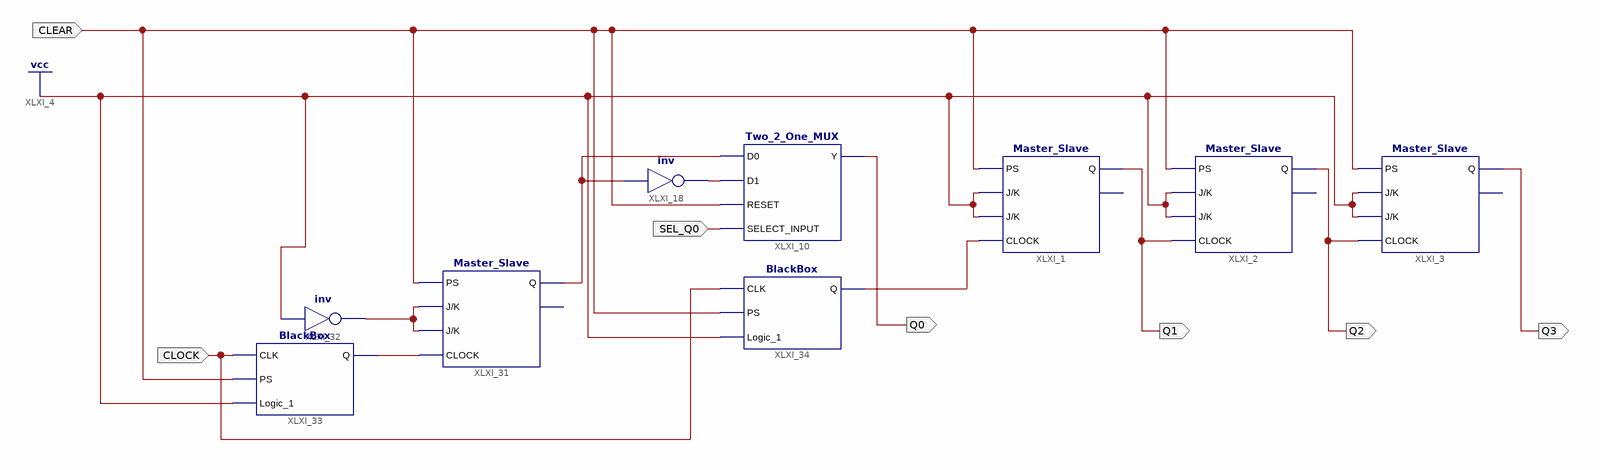
[diagram p0: schematic sheet 1]
// Xilinx ISE schematic ODD_EVEN.sch (artix7) as structural Verilog: 9 symbols, 7 ports
module ODD_EVEN (
  input  SEL_Q0,
  input  CLEAR,
  input  CLOCK,
  output Q1,
  output Q2,
  output Q3,
  output Q0
);

  wire CLOCK_1, CLOCK_2, XLXN_33, XLXN_36, XLXN_67;

  Master_Slave XLXI_1 (.CLOCK(CLOCK_2), .J(1'b1), .K(1'b1), .PS(CLEAR), .Q(Q1));  // open: Qb
  Master_Slave XLXI_2 (.CLOCK(Q1), .J(1'b1), .K(1'b1), .PS(CLEAR), .Q(Q2));  // open: Qb
  Master_Slave XLXI_3 (.CLOCK(Q2), .J(1'b1), .K(1'b1), .PS(CLEAR), .Q(Q3));  // open: Qb
  Two_2_One_MUX XLXI_10 (.D0(XLXN_67), .D1(XLXN_36), .RESET(CLEAR), .SELECT_INPUT(SEL_Q0), .Y(Q0));
  Master_Slave XLXI_31 (.CLOCK(CLOCK_1), .J(XLXN_33), .K(XLXN_33), .PS(CLEAR), .Q(XLXN_67));  // open: Qb
  not XLXI_32 (XLXN_33, 1'b1);
  not XLXI_18 (XLXN_36, XLXN_67);
  BlackBox XLXI_33 (.CLK(CLOCK), .Logic_1(1'b1), .PS(CLEAR), .Q(CLOCK_1));
  BlackBox XLXI_34 (.CLK(CLOCK), .Logic_1(1'b1), .PS(CLEAR), .Q(CLOCK_2));
endmodule
